# Altium schematic sheet main.SchDoc
size A4
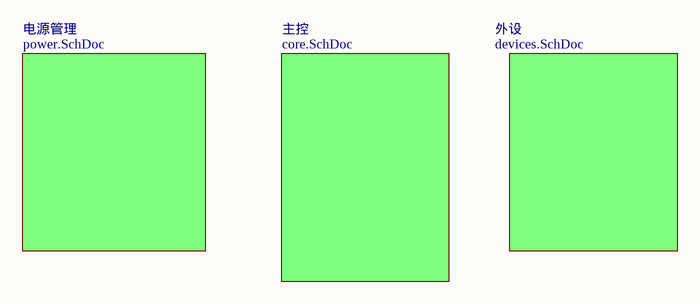
[diagram p0: main.SchDoc]

## Sub-sheets
主控 = core.SchDoc: no entries
外设 = devices.SchDoc: no entries
电源管理 = power.SchDoc: no entries